# EAGLE design Dreamcast (EAGLE 9.6.2)
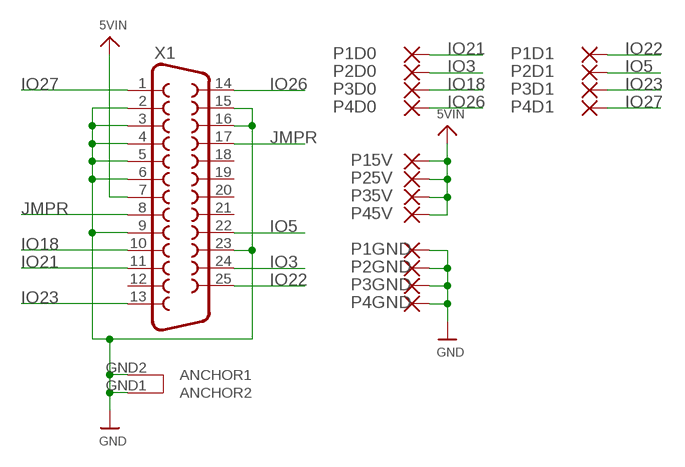
[diagram p0: schematic, sheet 1]

## Parts
P1D0  SMD5  [SMD2,54-5,08]
P1D1  SMD5  [SMD2,54-5,08]
P1GND  SMD5  [SMD2,54-5,08]
P2D0  SMD5  [SMD2,54-5,08]
P2D1  SMD5  [SMD2,54-5,08]
P2GND  SMD5  [SMD2,54-5,08]
P3D0  SMD5  [SMD2,54-5,08]
P3D1  SMD5  [SMD2,54-5,08]
P3GND  SMD5  [SMD2,54-5,08]
P4D0  SMD5  [SMD2,54-5,08]
P4D1  SMD5  [SMD2,54-5,08]
P4GND  SMD5  [SMD2,54-5,08]
P15V  SMD5  [SMD2,54-5,08]
P25V  SMD5  [SMD2,54-5,08]
P35V  SMD5  [SMD2,54-5,08]
P45V  SMD5  [SMD2,54-5,08]
X1  DB25_FEMALEHP  [F25HP]

## Nets
GND: P1GND.1(P) P2GND.1(P) P3GND.1(P) P4GND.1(P) X1.2 X1.3 X1.4 X1.5 X1.6 X1.9 X1.15 X1.16 X1.23 X1.GND1(ANCHOR2) X1.GND2(ANCHOR1)
IO3: P2D0.1(P) X1.24
IO5: P2D1.1(P) X1.22
IO18: P3D0.1(P) X1.10
IO21: P1D0.1(P) X1.11
IO22: P1D1.1(P) X1.25
IO23: P3D1.1(P) X1.13
IO26: P4D0.1(P) X1.14
IO27: P4D1.1(P) X1.1
JMPR: X1.8 X1.17
VIN: P15V.1(P) P25V.1(P) P35V.1(P) P45V.1(P) X1.7 ; supply symbol labelled 5VIN
Unconnected: X1.12 X1.18 X1.19 X1.20 X1.21

## Library data of the parts
P1D0 P1D1 P1GND P2D0 P2D1 P2GND P3D0 P3D1 P3GND P4D0 P4D1 P4GND P15V P25V P35V P45V = wirepad:SMD5: SMD PAD
X1 = SparkFun-Retired:DB25_FEMALE: 25 Pin male connector. PCB edge mount for regular PCB thicknesses. This connector will connect directly to the back of a PC parallel port or through a normal DB25 extension cable (M/F). SKU: PRT-08287

## Board
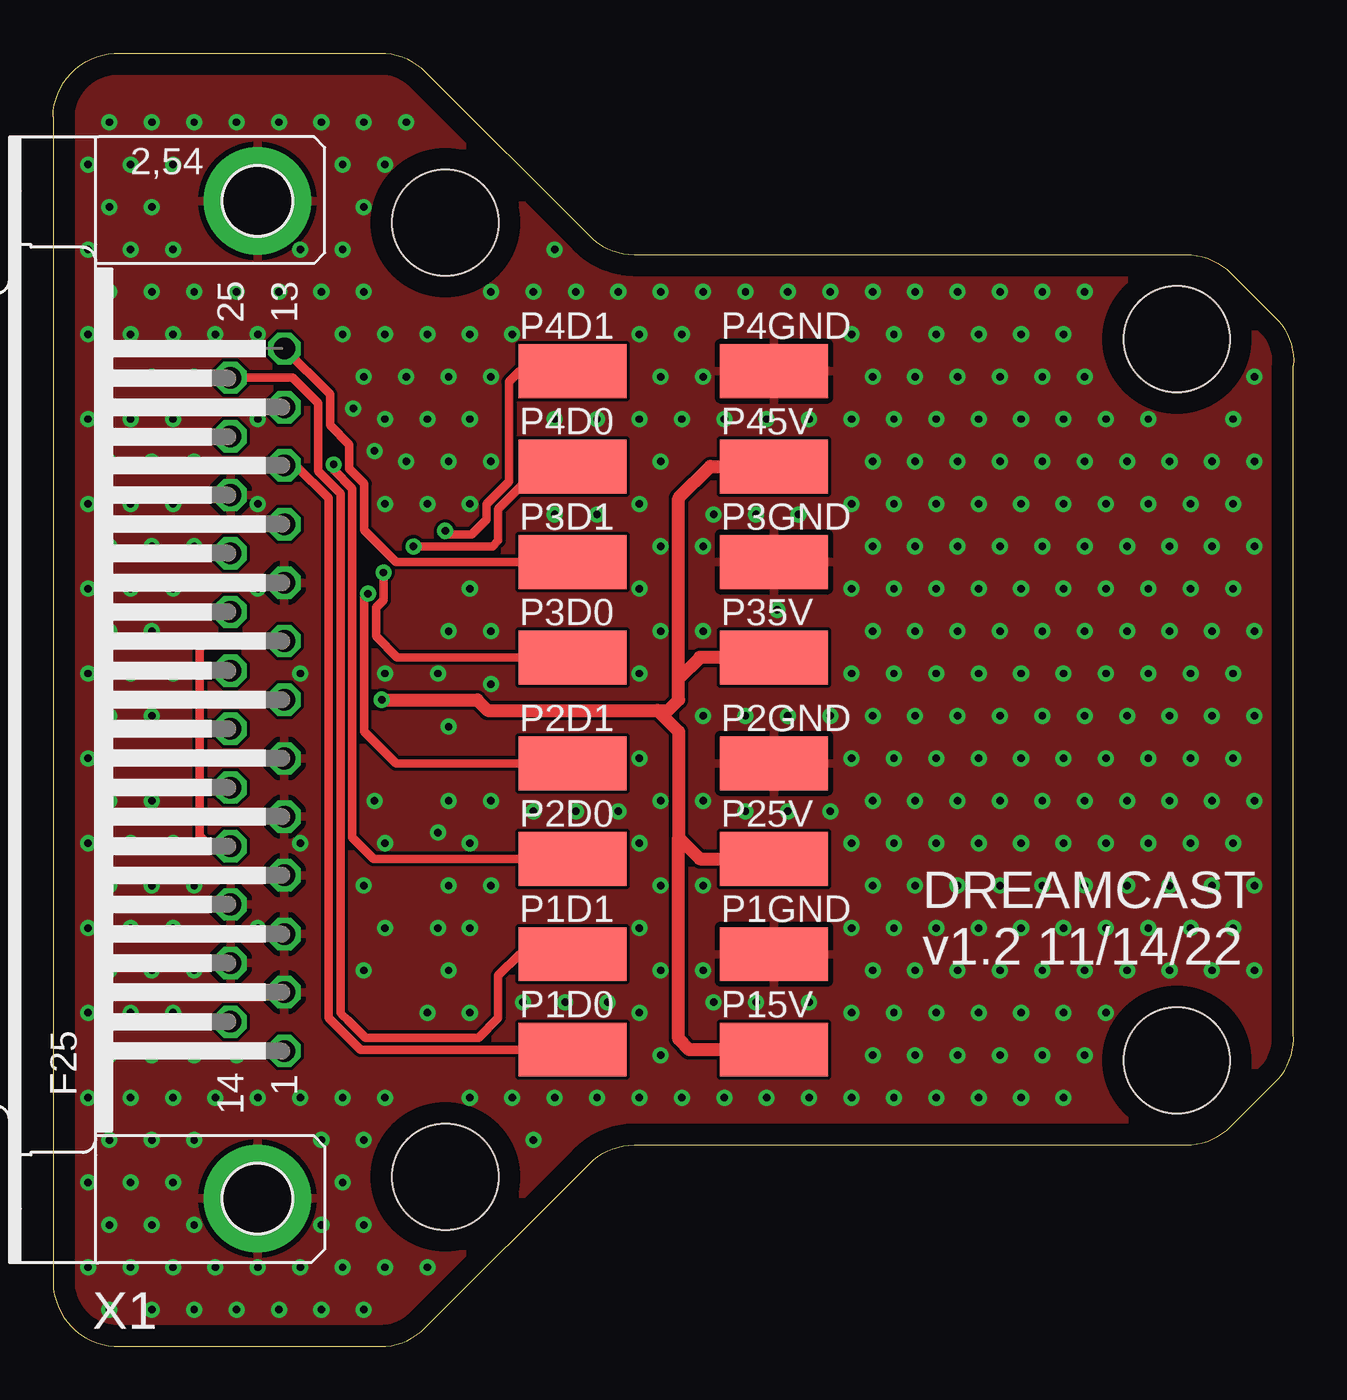
[diagram p1: board, top side]
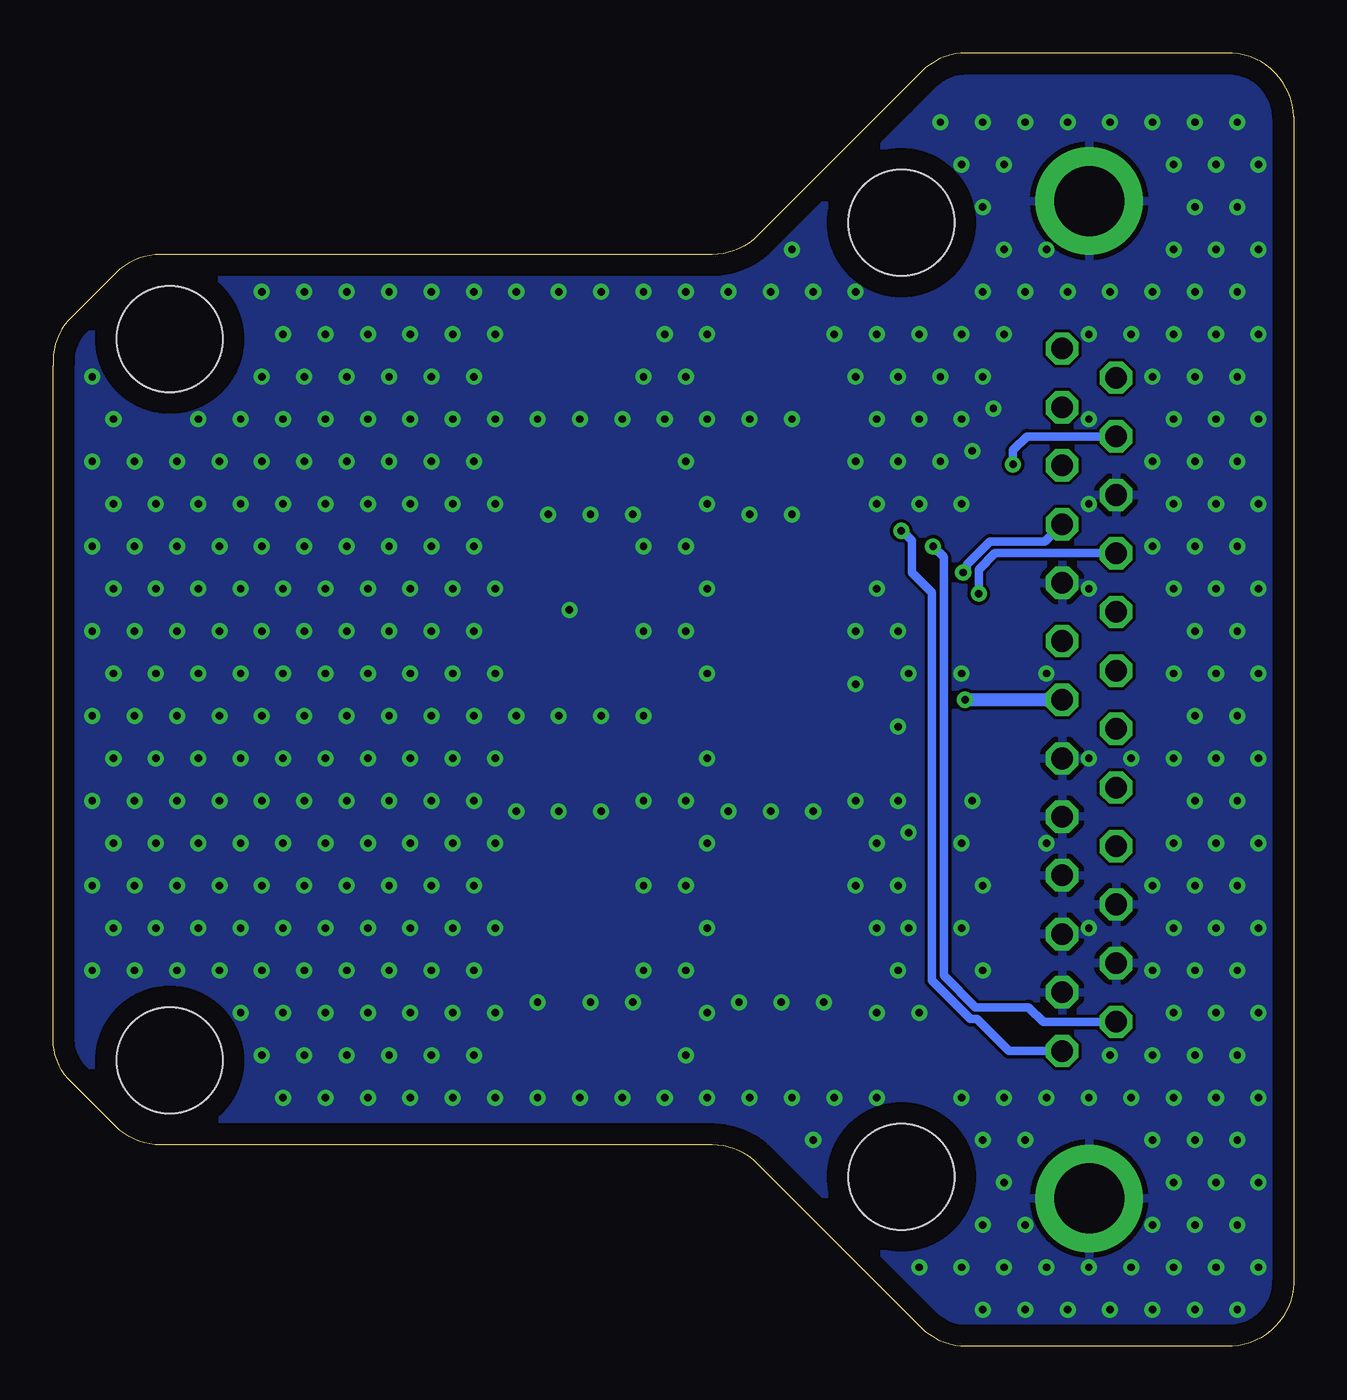
[diagram p2: board, bottom side, seen from below]

Size 58.51 x 61 mm. Coordinates in mm from the lower left corner, seen from the top.
Outline: 0,58 0,3 arc90 3.17,0 15.43,0 arc45 17.55,0.88 25.29,8.62 arc-45 27.41,9.5 53.43,9.5 arc45 55.55,10.38 57.79,12.62 arc45 58.5,14.74 58.5,46.26 arc45 57.79,48.38 55.55,50.62 arc45 53.43,51.5 27.41,51.5 arc-45 25.29,52.38 17.55,60.12 arc45 15.43,61 3.17,61 arc90 0,58
Copper layers (1*16): Top 0.035mm / dielectric 1.5mm / Bottom 0.035mm
Design rules "default": minimum track width 6mil, minimum drill 0.35mm, track to track 6mil, track to pad 6mil, pad to pad 6mil, via to via 6mil, smd to smd 6mil, copper to edge 40mil, drill to drill 6mil, minimum pad ring 10mil, minimum via ring 8mil, stop-mask expansion 4mil, vias tented up to drill 0.5mm, thermal gap 10mil
Holes 5 mm at 53,13.5 53,47.5 18.5,53 18.5,8

### Footprints (pad centres in the part's own frame; a part is rotated, then mirrored left to right if it is on the bottom)
SMD2,54-5,08 = smd 2.54 x 5.08: 1 0,0
F25HP = drill 1.016 octagon: 1 -16.561,-1.27; 2 -13.792,-1.27; 3 -11.049,-1.27; 4 -8.28,-1.27; 5 -5.512,-1.27; 6 -2.769,-1.27; 7 0,-1.27; 8 2.769,-1.27; 9 5.512,-1.27; 10 8.28,-1.27; 11 11.049,-1.27; 12 13.792,-1.27; 13 16.561,-1.27; 14 -15.189,1.27; 15 -12.421,1.27; 16 -9.652,1.27; 17 -6.909,1.27; 18 -4.14,1.27; 19 -1.372,1.27; 20 1.372,1.27; 21 4.14,1.27; 22 6.909,1.27; 23 9.652,1.27; 24 12.421,1.27; 25 15.189,1.27 | drill 3.302 pad 5.08: GND1 -23.52,0; GND2 23.52,0

### Placement (x,y rotation side)
P1D0  24.5,14 270 top
P1D1  24.5,18.5 270 top
P1GND  34,18.5 270 top
P2D0  24.5,23 270 top
P2D1  24.5,27.5 270 top
P2GND  34,27.5 270 top
P3D0  24.5,32.5 270 top
P3D1  24.5,37 270 top
P3GND  34,37 270 top
P4D0  24.5,41.5 270 top
P4D1  24.5,46 270 top
P4GND  34,46 270 top
P15V  34,14 270 top
P25V  34,23 270 top
P35V  34,32.5 270 top
P45V  34,41.5 270 top
X1  9.64,30.5 90 top

### Tracks (layer width: path | path; a pad name or v marks a point on that pad's centre or on a via)
GND  (via drill 0.35)
  other vias: 2.66,1.74 1.66,3.74 2.66,5.74 1.66,7.74 2.66,9.74 1.66,11.74 2.66,13.74 1.66,15.74 2.66,17.74 1.66,19.74 2.66,21.74 1.66,23.74 2.66,25.74 1.66,27.74 2.66,29.74 1.66,31.74 2.66,33.74 1.66,35.74 2.66,37.74 1.66,39.74 2.66,41.74 1.66,43.74 2.66,45.74 1.66,47.74 2.66,49.74 1.66,51.74 2.66,53.74 1.66,55.74 2.66,57.74 4.66,1.74 3.66,3.74 4.66,5.74 3.66,7.74 4.66,9.74 3.66,11.74 4.66,13.74 3.66,15.74 4.66,17.74 3.66,19.74 4.66,21.74 3.66,23.74 4.66,25.74 3.66,27.74 4.66,29.74 3.66,31.74 4.66,33.74 3.66,35.74 4.66,37.74 3.66,39.74 4.66,41.74 3.66,43.74 4.66,45.74 3.66,47.74 4.66,49.74 3.66,51.74 4.66,53.74 3.66,55.74 4.66,57.74 6.66,1.74 5.66,3.74 6.66,5.74 5.66,7.74 6.66,9.74 5.66,11.74 6.66,13.74 5.66,15.74 6.66,17.74 5.66,19.74 6.66,21.74 5.66,23.74 5.66,27.74 5.66,31.74 5.66,35.74 6.66,37.74 5.66,39.74 6.66,41.74 5.66,43.74 6.66,45.74 5.66,47.74 6.66,49.74 5.66,51.74 5.66,55.74 6.66,57.74 8.66,1.74 7.66,3.74 7.66,11.74 8.66,13.74 7.66,27.74 7.66,47.74 8.66,49.74 8.66,57.74 10.66,1.74 9.66,3.74 9.66,11.74 9.66,19.74 9.66,27.74 9.66,35.74 9.66,39.74 9.66,43.74 9.66,47.74 10.66,49.74 10.66,57.74 12.66,1.74 11.66,3.74 12.66,5.74 12.66,9.74 11.66,11.74 11.66,23.74 11.66,31.74 12.66,49.74 11.66,51.74 12.66,57.74 14.66,1.74 13.66,3.74 14.66,5.74 13.66,7.74 14.66,9.74 13.66,11.74 14.66,17.74 14.66,21.74 15.16,25.74 15.16,42.24 14.16,44.24 14.66,45.74 13.66,47.74 14.66,49.74 13.66,51.74 14.66,53.74 13.66,55.74 14.66,57.74 15.66,3.74 15.66,11.74 15.66,19.74 15.66,23.74 15.66,31.74 15.66,39.74 16.66,41.74 15.66,43.74 16.66,45.74 15.66,47.74 15.66,55.74 16.66,57.74 17.66,3.74 17.66,15.74 18.66,17.74 18.16,19.74 18.66,21.74 18.16,24.24 18.66,25.74 18.66,29.24 18.16,31.74 18.66,33.74 17.66,39.74 18.66,41.74 17.66,43.74 18.66,45.74 17.66,47.74 19.66,11.74 19.66,15.74 19.66,19.74 20.66,21.74 19.66,23.74 20.66,25.74 20.66,31.24 20.66,33.74 19.66,35.74 19.66,39.74 20.66,41.74 19.66,43.74 20.66,45.74 19.66,47.74 20.66,49.74 22.66,9.74 21.66,11.74 22.16,16.24 22.66,25.24 21.66,47.74 22.66,49.74 23.66,11.74 24.16,16.24 24.66,25.24 23.66,39.24 23.66,43.74 24.66,49.74 23.66,51.74 25.66,11.74 26.16,16.24 26.66,25.24 25.66,39.24 25.66,43.74 26.66,49.74 27.66,11.74 28.66,13.74 27.66,15.74 28.66,17.74 27.66,19.74 28.66,21.74 27.66,23.74 28.66,25.74 27.66,27.74 27.66,31.74 28.66,33.74 27.66,35.74 28.66,37.74 27.66,39.74 28.66,41.74 27.66,43.74 28.66,45.74 27.66,47.74 28.66,49.74 29.66,11.74 30.66,17.74 30.66,21.74 30.66,25.74 30.66,29.74 30.66,33.74 30.66,37.74 29.66,43.74 30.66,45.74 29.66,47.74 30.66,49.74 31.66,11.74 31.16,16.24 32.66,25.24 32.66,29.74 31.16,39.24 31.66,43.74 32.66,49.74 33.66,11.74 33.16,16.24 34.66,25.24 34.66,29.74 34.16,34.74 33.16,39.24 33.66,43.74 34.66,49.74 35.66,11.74 35.66,16.24 36.66,25.24 36.66,29.74 35.16,39.24 35.66,43.74 36.66,49.74 37.66,11.74 38.66,13.74 37.66,15.74 38.66,17.74 37.66,19.74 38.66,21.74 37.66,23.74 38.66,25.74 37.66,27.74 38.66,29.74 37.66,31.74 38.66,33.74 37.66,35.74 38.66,37.74 37.66,39.74 38.66,41.74 37.66,43.74 38.66,45.74 37.66,47.74 38.66,49.74 39.66,11.74 40.66,13.74 39.66,15.74 40.66,17.74 39.66,19.74 40.66,21.74 39.66,23.74 40.66,25.74 39.66,27.74 40.66,29.74 39.66,31.74 40.66,33.74 39.66,35.74 40.66,37.74 39.66,39.74 40.66,41.74 39.66,43.74 40.66,45.74 39.66,47.74 40.66,49.74 41.66,11.74 42.66,13.74 41.66,15.74 42.66,17.74 41.66,19.74 42.66,21.74 41.66,23.74 42.66,25.74 41.66,27.74 42.66,29.74 41.66,31.74 42.66,33.74 41.66,35.74 42.66,37.74 41.66,39.74 42.66,41.74 41.66,43.74 42.66,45.74 41.66,47.74 42.66,49.74 43.66,11.74 44.66,13.74 43.66,15.74 44.66,17.74 43.66,19.74 44.66,21.74 43.66,23.74 44.66,25.74 43.66,27.74 44.66,29.74 43.66,31.74 44.66,33.74 43.66,35.74 44.66,37.74 43.66,39.74 44.66,41.74 43.66,43.74 44.66,45.74 43.66,47.74 44.66,49.74 45.66,11.74 46.66,13.74 45.66,15.74 46.66,17.74 45.66,19.74 46.66,21.74 45.66,23.74 46.66,25.74 45.66,27.74 46.66,29.74 45.66,31.74 46.66,33.74 45.66,35.74 46.66,37.74 45.66,39.74 46.66,41.74 45.66,43.74 46.66,45.74 45.66,47.74 46.66,49.74 47.66,11.74 48.66,13.74 47.66,15.74 48.66,17.74 47.66,19.74 48.66,21.74 47.66,23.74 48.66,25.74 47.66,27.74 48.66,29.74 47.66,31.74 48.66,33.74 47.66,35.74 48.66,37.74 47.66,39.74 48.66,41.74 47.66,43.74 48.66,45.74 47.66,47.74 48.66,49.74 49.66,15.74 50.66,17.74 49.66,19.74 50.66,21.74 49.66,23.74 50.66,25.74 49.66,27.74 50.66,29.74 49.66,31.74 50.66,33.74 49.66,35.74 50.66,37.74 49.66,39.74 50.66,41.74 49.66,43.74 52.66,17.74 51.66,19.74 52.66,21.74 51.66,23.74 52.66,25.74 51.66,27.74 52.66,29.74 51.66,31.74 52.66,33.74 51.66,35.74 52.66,37.74 51.66,39.74 52.66,41.74 51.66,43.74 54.66,17.74 53.66,19.74 54.66,21.74 53.66,23.74 54.66,25.74 53.66,27.74 54.66,29.74 53.66,31.74 54.66,33.74 53.66,35.74 54.66,37.74 53.66,39.74 54.66,41.74 56.66,17.74 55.66,19.74 56.66,21.74 55.66,23.74 56.66,25.74 55.66,27.74 56.66,29.74 55.66,31.74 56.66,33.74 55.66,35.74 56.66,37.74 55.66,39.74 56.66,41.74 55.66,43.74 56.66,45.74
  pour Top: 0,0 0,61 28.67,61 28.67,51.5 59.17,51.5 59.17,9.5 28.17,9.5 28.17,0
  pour Bottom: 0,0 0,61 28.67,61 28.67,51.5 59.17,51.5 59.17,9.5 28.17,9.5 28.17,0
IO3  (via drill 0.35)
  Top 0.406: P2D0.1 15.12,23 14.12,24 14.12,40.46 13.23,41.35 v13.23,41.59
  Bottom 0.406: v13.23,41.59 13.23,42.27 12.58,42.92 X1.24
IO5  (via drill 0.35)
  Top 0.406: P2D1.1 16.18,27.5 14.68,29 14.68,35.33 v14.85,35.5
  Bottom 0.406: v14.85,35.5 14.85,36.65 14.09,37.41 X1.22
IO18  (via drill 0.35)
  Top 0.406: P3D0.1 16.23,32.5 15.23,33.5 15.23,34.85 15.59,35.2 v15.59,36.5
  Bottom 0.406: X1.10 11.72,37.97 14.32,37.97 15.41,36.88 15.41,36.67 v15.59,36.5
IO21
  Top 0.406: P1D0.1 14.5,14 13,15.5 13,40 11.45,41.55 X1.11
IO22
  Top 0.406: P1D1.1 22,18.5 21,17.5 21,15.5 20.06,14.56 14.73,14.56 13.89,15.39 13.64,15.64 13.56,15.73 13.56,40.23 12.5,41.29 12.5,44.5 11.31,45.69 X1.25
IO23
  Top 0.406: P3D1.1 16.18,37 14.68,38.5 14.68,40.69 13.97,41.4 13.97,42.53 13.06,43.44 13.06,44.91 X1.13
IO26  (via drill 0.35)
  Top 0.406: P4D0.1 23,41.5 21,39.5 21,38 20.73,37.73 v17,37.73
  Bottom 0.406: v17,37.73 16.5,37.23 16.5,17.5 15,16 12.5,16 11.81,15.31 X1.14
IO27  (via drill 0.35)
  Top 0.406: P4D1.1 22,46 21.5,45.5 21.5,40.79 20.44,39.73 20.44,39 19.73,38.29 18.68,38.29 v18.5,38.47
  Bottom 0.406: v18.5,38.47 18.47,38.47 18,38 18,36.5 17.06,35.56 17.06,17.27 15.23,15.44 14.94,15.44 13.44,13.94 X1.1
JMPR
  Top 0.406: X1.8 7.27,33.27 6.92,32.92 6.92,24.08 7.5,23.5 8.28,23.5 X1.17
VIN  (via drill 0.35)
  Top 0.61: 29.5,31.5 29.5,30.5 29,30 28.5,30 | 29.5,31.5 29.5,40 31,41.5 P45V.1 | v15.5,30.5 20,30.5 20.5,30 28.5,30 | 29.5,31.5 30.5,32.5 P35V.1 | 28.5,30 29.5,29 29.5,24.5 29.5,24 | 29.5,24 30.5,23 P25V.1 | P15V.1 30,14 29.5,14.5 29.5,24
  Bottom 0.61: X1.7 v15.5,30.5

### Text on the board
tPlace: DREAMCAST / v1.2 11/14/22